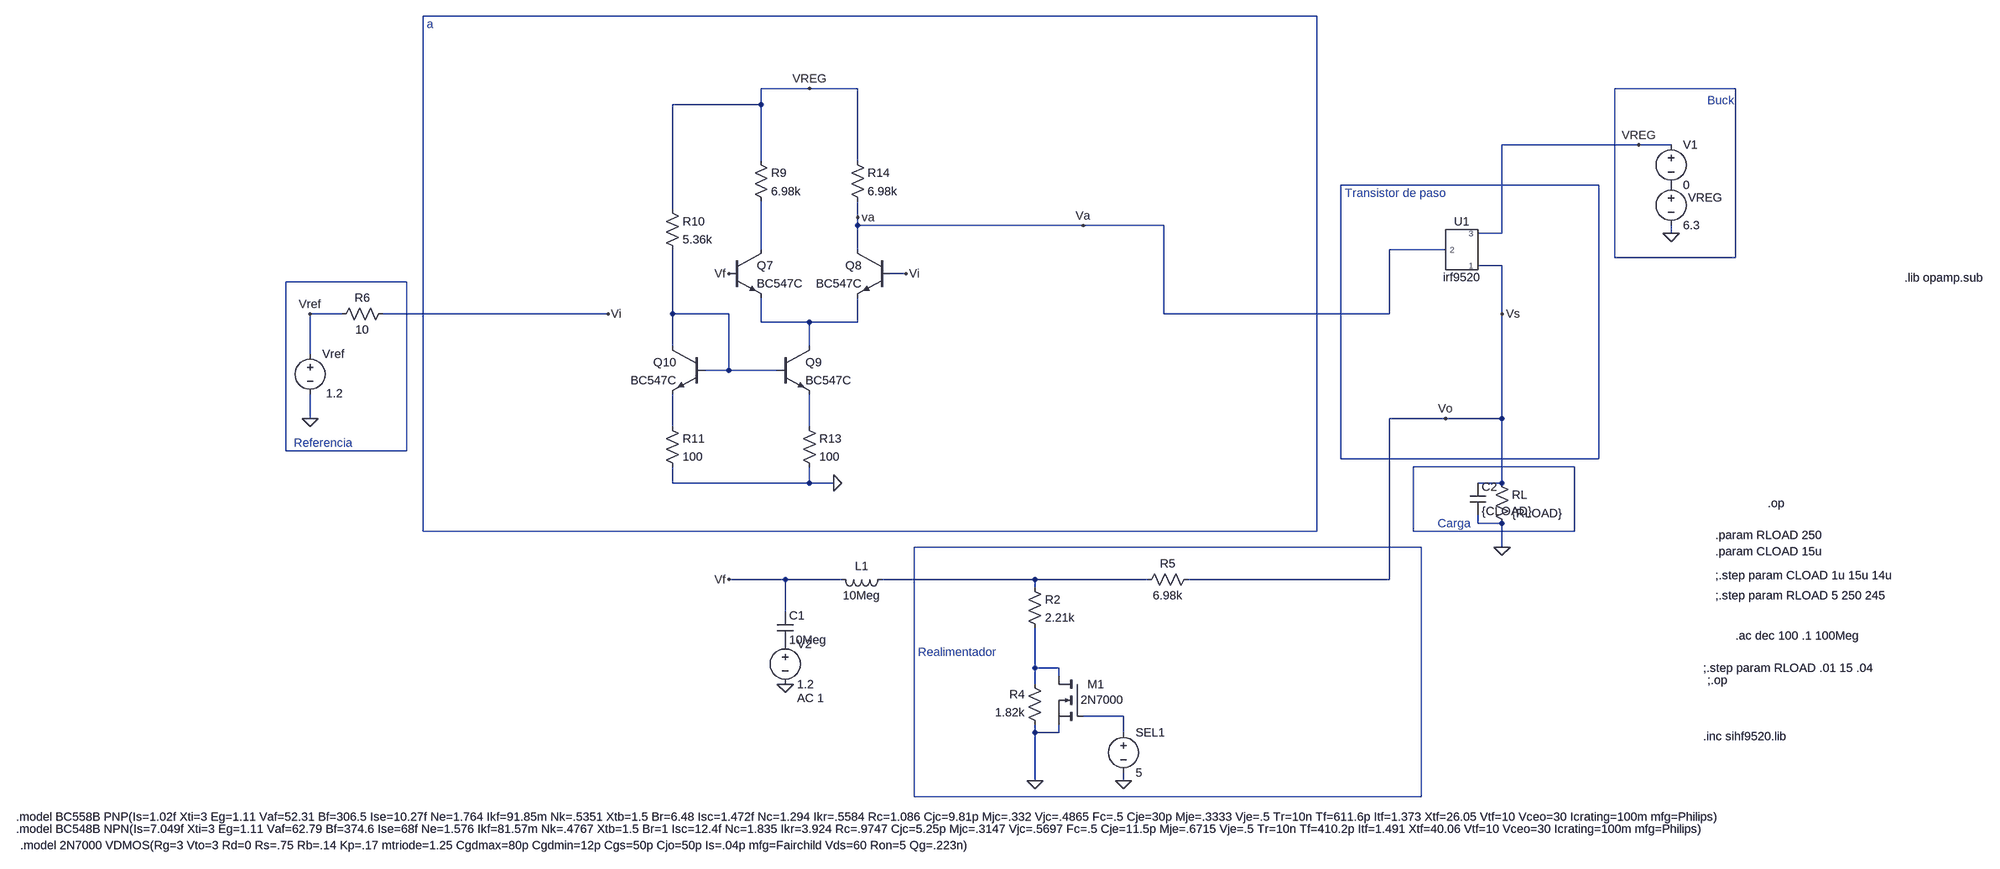
[diagram p0: schematic LDO_sin_compensarV.asc]
LDO_sin_compensarV.asc, the LTspice schematic file:
Version 4
SHEET 1 26844 1204
WIRE 1264 -480 -512 -480
WIRE 256 -336 160 -336
WIRE 352 -336 256 -336
WIRE 2096 -336 1856 -336
WIRE 160 -304 160 -336
WIRE 160 -304 -16 -304
WIRE 1904 -224 1632 -224
WIRE 1968 -224 1904 -224
WIRE 160 -192 160 -304
WIRE 352 -192 352 -336
WIRE 1824 -144 1312 -144
WIRE -16 -96 -16 -304
WIRE 352 -80 352 -112
WIRE 352 -64 352 -80
WIRE 800 -64 352 -64
WIRE 960 -64 800 -64
WIRE 1632 -48 1632 -224
WIRE 1632 -48 1584 -48
WIRE 1968 -48 1968 -64
WIRE 160 -16 160 -112
WIRE 352 -16 352 -64
WIRE 1520 -16 1408 -16
WIRE 1856 0 1856 -336
WIRE 2096 0 2096 -336
WIRE 2096 0 1856 0
WIRE 1632 16 1584 16
WIRE 448 32 416 32
WIRE -544 48 -784 48
WIRE -672 112 -736 112
WIRE -144 112 -592 112
WIRE -16 112 -16 -16
WIRE 96 112 -16 112
WIRE 960 112 960 -64
WIRE 1408 112 1408 -16
WIRE 1408 112 960 112
WIRE 1632 112 1632 16
WIRE 160 128 160 80
WIRE 256 128 160 128
WIRE 352 128 352 80
WIRE 352 128 256 128
WIRE -16 176 -16 112
WIRE 256 176 256 128
WIRE -736 192 -736 112
WIRE 96 224 96 112
WIRE 96 224 48 224
WIRE 192 224 96 224
WIRE -736 320 -736 272
WIRE 1520 320 1408 320
WIRE 1632 320 1632 112
WIRE 1632 320 1520 320
WIRE -16 336 -16 272
WIRE 256 336 256 272
WIRE -784 384 -784 48
WIRE -544 384 -544 48
WIRE -544 384 -784 384
WIRE 1312 400 1312 -144
WIRE 1824 400 1824 -144
WIRE 1824 400 1312 400
WIRE 1776 416 1456 416
WIRE -16 448 -16 416
WIRE 256 448 256 416
WIRE 256 448 -16 448
WIRE 304 448 256 448
WIRE 1632 448 1632 320
WIRE 1632 448 1584 448
WIRE 1584 528 1584 512
WIRE 1632 528 1584 528
WIRE -512 544 -512 -480
WIRE 1264 544 1264 -480
WIRE 1264 544 -512 544
WIRE 1456 544 1456 416
WIRE 1776 544 1776 416
WIRE 1776 544 1456 544
WIRE 1472 576 464 576
WIRE 1632 576 1632 528
WIRE 208 640 96 640
WIRE 320 640 208 640
WIRE 704 640 400 640
WIRE 928 640 704 640
WIRE 1408 640 1408 320
WIRE 1408 640 1008 640
WIRE 704 656 704 640
WIRE 208 704 208 640
WIRE 704 816 704 736
WIRE 752 816 704 816
WIRE 752 832 752 816
WIRE 704 848 704 816
WIRE 880 912 800 912
WIRE 704 944 704 928
WIRE 752 944 752 928
WIRE 752 944 704 944
WIRE 880 944 880 912
WIRE 704 1040 704 944
WIRE 880 1040 880 1024
WIRE 464 1072 464 576
WIRE 1472 1072 1472 576
WIRE 1472 1072 464 1072
FLAG 1632 576 0
FLAG -736 320 0
FLAG 800 -64 Va
FLAG -736 112 Vref
FLAG 1520 320 Vo
FLAG 1968 -48 0
FLAG 96 640 Vf
FLAG -144 112 Vi
FLAG 1904 -224 VREG
FLAG 1632 112 Vs
FLAG 208 848 0
FLAG 304 448 0
FLAG 256 -336 VREG
FLAG 352 -80 va
FLAG 448 32 Vi
FLAG 96 32 Vf
FLAG 704 1040 0
FLAG 880 1040 0
SYMBOL voltage -736 176 R0
WINDOW 123 0 0 Left 0
WINDOW 39 0 0 Left 0
WINDOW 3 66 94 Right 2
SYMATTR Value 1.2
SYMATTR InstName Vref
SYMBOL res 1616 432 R0
SYMATTR InstName RL
SYMATTR Value {RLOAD}
SYMBOL voltage 1968 -160 R0
WINDOW 123 0 0 Left 0
WINDOW 39 0 0 Left 0
WINDOW 0 34 41 Left 2
SYMATTR InstName VREG
SYMATTR Value 6.3
SYMBOL voltage 1968 -240 R0
WINDOW 123 0 0 Left 0
WINDOW 39 0 0 Left 0
SYMATTR InstName V1
SYMATTR Value 0
SYMBOL res -576 96 R90
WINDOW 0 0 56 VBottom 2
WINDOW 3 32 56 VTop 2
SYMATTR InstName R6
SYMATTR Value 10
SYMBOL AutoGenerated\\irf9520 1552 -16 R0
SYMATTR InstName U1
SYMBOL ind 416 624 R90
WINDOW 0 5 56 VBottom 2
WINDOW 3 32 56 VTop 2
SYMATTR InstName L1
SYMATTR Value 10Meg
SYMBOL cap 192 704 R0
SYMATTR InstName C1
SYMATTR Value 10Meg
SYMBOL voltage 208 752 R0
WINDOW 123 24 124 Left 2
WINDOW 39 0 0 Left 0
SYMATTR Value2 AC 1
SYMATTR InstName V2
SYMATTR Value 1.2
SYMBOL cap 1568 448 R0
SYMATTR InstName C2
SYMATTR Value {CLOAD}
SYMBOL npn 96 -16 R0
SYMATTR InstName Q7
SYMATTR Value BC547C
SYMBOL npn 416 -16 M0
SYMATTR InstName Q8
SYMATTR Value BC547C
SYMBOL res 144 -208 R0
SYMATTR InstName R9
SYMATTR Value 6.98k
SYMBOL npn 192 176 R0
SYMATTR InstName Q9
SYMATTR Value BC547C
SYMBOL npn 48 176 M0
SYMATTR InstName Q10
SYMATTR Value BC547C
SYMBOL res -32 -112 R0
SYMATTR InstName R10
SYMATTR Value 5.36k
SYMBOL res -32 320 R0
SYMATTR InstName R11
SYMATTR Value 100
SYMBOL res 240 320 R0
SYMATTR InstName R13
SYMATTR Value 100
SYMBOL res 336 -208 R0
SYMATTR InstName R14
SYMATTR Value 6.98k
SYMBOL res 688 640 R0
SYMATTR InstName R2
SYMATTR Value 2.21k
SYMBOL res 720 944 R180
WINDOW 0 36 76 Left 2
WINDOW 3 36 40 Left 2
SYMATTR InstName R4
SYMATTR Value 1.82k
SYMBOL res 1024 624 R90
WINDOW 0 0 56 VBottom 2
WINDOW 3 32 56 VTop 2
SYMATTR InstName R5
SYMATTR Value 6.98k
SYMBOL voltage 880 928 R0
WINDOW 123 0 0 Left 0
WINDOW 39 0 0 Left 0
SYMATTR InstName SEL1
SYMATTR Value 5
SYMBOL nmos 800 832 M0
WINDOW 0 -42 16 Left 2
WINDOW 3 -80 47 Left 2
SYMATTR InstName M1
SYMATTR Value 2N7000
TEXT -768 368 Left 2 ;Referencia
TEXT -504 -464 Left 2 ;a
TEXT 1320 -128 Left 2 ;Transistor de paso
TEXT 1504 528 Left 2 ;Carga
TEXT 2032 816 Left 2 !;.step param RLOAD .01 15 .04
TEXT -1320 1112 Left 2 !.model BC558B PNP(Is=1.02f Xti=3 Eg=1.11 Vaf=52.31 Bf=306.5 Ise=10.27f Ne=1.764 Ikf=91.85m Nk=.5351 Xtb=1.5 Br=6.48 Isc=1.472f Nc=1.294 Ikr=.5584 Rc=1.086 Cjc=9.81p Mjc=.332 Vjc=.4865 Fc=.5 Cje=30p Mje=.3333 Vje=.5 Tr=10n Tf=611.6p Itf=1.373 Xtf=26.05 Vtf=10 Vceo=30 Icrating=100m mfg=Philips)
TEXT -1320 1136 Left 2 !.model BC548B NPN(Is=7.049f Xti=3 Eg=1.11 Vaf=62.79 Bf=374.6 Ise=68f Ne=1.576 Ikf=81.57m Nk=.4767 Xtb=1.5 Br=1 Isc=12.4f Nc=1.835 Ikr=3.924 Rc=.9747 Cjc=5.25p Mjc=.3147 Vjc=.5697 Fc=.5 Cje=11.5p Mje=.6715 Vje=.5 Tr=10n Tf=410.2p Itf=1.491 Xtf=40.06 Vtf=10 Vceo=30 Icrating=100m mfg=Philips)
TEXT 2040 840 Left 2 !;.op
TEXT 2040 -312 Left 2 ;Buck
TEXT 2032 952 Left 2 !.inc sihf9520.lib
TEXT -1312 1168 Left 2 !.model 2N7000 VDMOS(Rg=3 Vto=3 Rd=0 Rs=.75 Rb=.14 Kp=.17 mtriode=1.25 Cgdmax=80p Cgdmin=12p Cgs=50p Cjo=50p Is=.04p mfg=Fairchild Vds=60 Ron=5 Qg=.223n)
TEXT 2432 40 Left 2 !.lib opamp.sub
TEXT 2096 752 Left 2 !.ac dec 100 .1 100Meg
TEXT 2056 672 Left 2 !;.step param RLOAD 5 250 245
TEXT 2056 632 Left 2 !;.step param CLOAD 1u 15u 14u
TEXT 2056 584 Left 2 !.param CLOAD 15u
TEXT 2056 552 Left 2 !.param RLOAD 250
TEXT 2160 488 Left 2 !.op
TEXT 472 784 Left 2 ;Realimentador

The netlist it stands for:
* LDO_sin_compensarV.asc
Vref Vref 0 1.2
RL Vs 0 {RLOAD}
VREG P001 0 6.3
V1 VREG P001 0
R6 Vi Vref 10
XU1 Vs Va VREG irf9520  ; pins 1 2 3
L1 N012 Vf 10Meg
C1 Vf P002 10Meg
V2 P002 0 1.2 AC 1
C2 Vs 0 {CLOAD}
Q7 N004 Vf N007 0 BC547C
Q8 Va Vi N007 0 BC547C
R9 VREG N004 6.98k
Q9 N007 N006 N009 0 BC547C
Q10 N006 N006 N008 0 BC547C
R10 VREG N006 5.36k
R11 N008 0 100
R13 N009 0 100
R14 VREG Va 6.98k
R2 N012 N013 2.21k
R4 0 N013 1.82k
R5 Vs N012 6.98k
V§SEL1 N014 0 5
M1 N013 N014 0 0 2N7000
.model NPN NPN
.model PNP PNP
.lib standard.bjt
.model NMOS NMOS
.model PMOS PMOS
.lib standard.mos
* Referencia
* a
* Transistor de paso
* Carga
;.step param RLOAD .01 15 .04
.model BC558B PNP(Is=1.02f Xti=3 Eg=1.11 Vaf=52.31 Bf=306.5 Ise=10.27f Ne=1.764 Ikf=91.85m Nk=.5351 Xtb=1.5 Br=6.48 Isc=1.472f Nc=1.294 Ikr=.5584 Rc=1.086 Cjc=9.81p Mjc=.332 Vjc=.4865 Fc=.5 Cje=30p Mje=.3333 Vje=.5 Tr=10n Tf=611.6p Itf=1.373 Xtf=26.05 Vtf=10 Vceo=30 Icrating=100m mfg=Philips)
.model BC548B NPN(Is=7.049f Xti=3 Eg=1.11 Vaf=62.79 Bf=374.6 Ise=68f Ne=1.576 Ikf=81.57m Nk=.4767 Xtb=1.5 Br=1 Isc=12.4f Nc=1.835 Ikr=3.924 Rc=.9747 Cjc=5.25p Mjc=.3147 Vjc=.5697 Fc=.5 Cje=11.5p Mje=.6715 Vje=.5 Tr=10n Tf=410.2p Itf=1.491 Xtf=40.06 Vtf=10 Vceo=30 Icrating=100m mfg=Philips)
;.op
* Buck
.inc sihf9520.lib
.model 2N7000 VDMOS(Rg=3 Vto=3 Rd=0 Rs=.75 Rb=.14 Kp=.17 mtriode=1.25 Cgdmax=80p Cgdmin=12p Cgs=50p Cjo=50p Is=.04p mfg=Fairchild Vds=60 Ron=5 Qg=.223n)
.lib opamp.sub
.ac dec 100 .1 100Meg
;.step param RLOAD 5 250 245
;.step param CLOAD 1u 15u 14u
.param CLOAD 15u
.param RLOAD 250
.op
* Realimentador
.lib sihf9520.txt
.backanno
.end